# EasyEDA schematic easy-eda-project.json
TITLE: Lukso Tag - Build Up #2 Hackathon; REV: 3.0; Date: 2023-11-15; Sheet: 1/1; Drawn By: Tuszy; Company: Tuszy
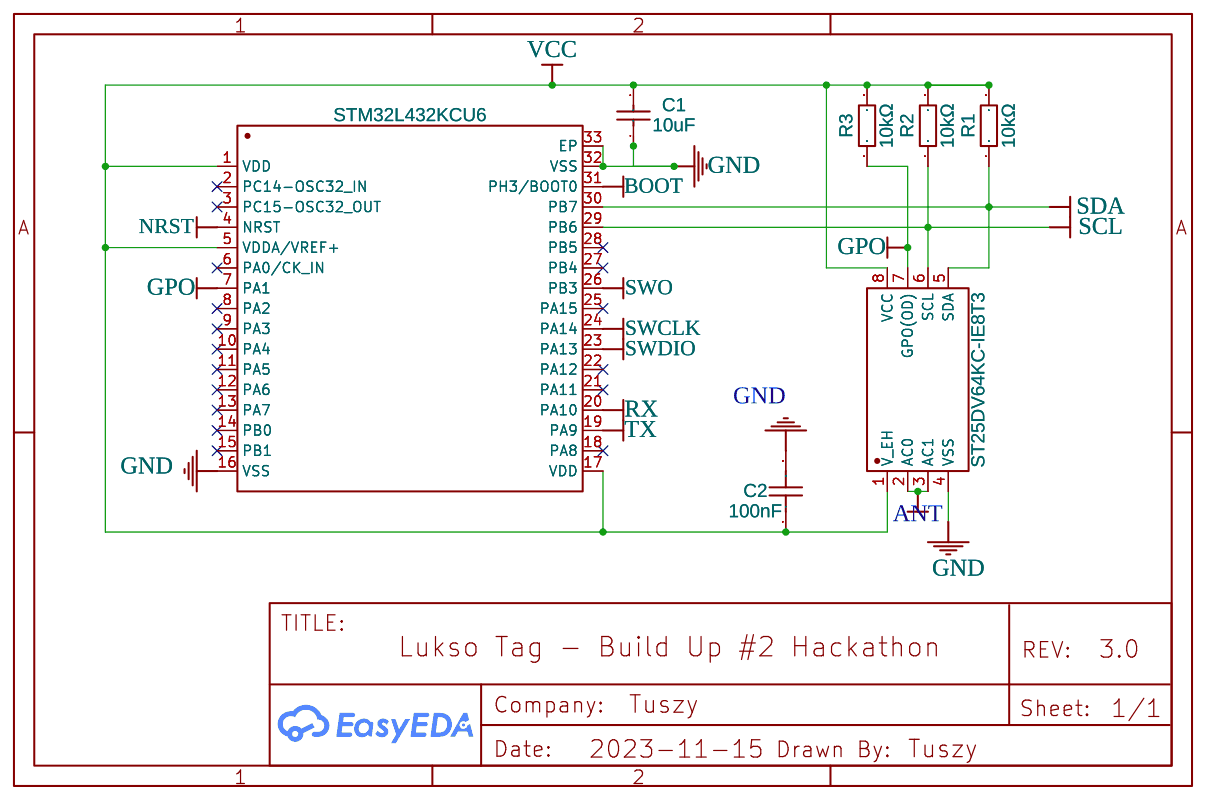
[diagram p0: schematic sheet]

## Parts
C1  10uF  [C0402]
C2  100nF  [C0402]
R1  10kΩ  [R0402]
R2  10kΩ  [R0402]
R3  10kΩ  [R0402]
U1  STM32L432KCU6  [UFQFPN-32_L5.0-W5.0-P0.50-TL-EP3.5]
U3  ST25DV64KC-IE8T3  [TSSOP-8_L4.4-W3.0-P0.65-LS6.4-BL]

## Library data of the parts
C1 = CL05A106MQ5NUNC: Supplier: LCSC; Manufacturer: SAMSUNG(三星); Supplier Part: C15525; JLCPCB Part Class: Basic Part; link: https://lcsc.com/eda_search?q=C15525&%26type=1&ref=editor
C2 = CC0402JRX7R7BB104: Contributor: LCSC; Supplier: LCSC; Supplier Part: C541464; Manufacturer: YAGEO(国巨); JLCPCB Part Class: Extended Part; link: https://lcsc.com/eda_search?q=C541464&%26type=1&ref=editor
R1-R3 = 0402WGF1002TCE: Supplier: LCSC; Manufacturer: UNI-ROYAL(厚声); Supplier Part: C25744; JLCPCB Part Class: Basic Part; link: https://lcsc.com/eda_search?q=C25744&%26type=1&ref=editor
U1 = STM32L432KCU6: Contributor: LCSC; Supplier: LCSC; Supplier Part: C1337280; Manufacturer: ST(意法半导体); JLCPCB Part Class: Extended Part; link: https://lcsc.com/eda_search?q=C1337280&%26type=1&ref=editor
U3 = ST25DV64KC-IE8T3: Contributor: lcsc; Supplier: LCSC; Supplier Part: C3304589; Manufacturer: ST(意法半导体); link: https://lcsc.com/eda_search?q=C3304589&%26type=1&ref=editor

## Nets
GND: C1.1 C2.2 U1.16(VSS) U1.32(VSS) U1.33(EP) U3.4(VSS)
VCC: C1.2 C2.1 R1.2 R2.2 R3.2 U1.1(VDD) U1.5(VDDA/VREF+) U1.17(VDD) U3.1(V_EH) U3.8(VCC)
ANT: U3.2(AC0) U3.3(AC1)
BOOT: U1.31(PH3/BOOT0)
GPO: R3.1 U1.7(PA1) U3.7(GPO(OD))
NRST: U1.4(NRST)
RX: U1.20(PA10)
SCL: R2.1 U1.29(PB6) U3.6(SCL)
SDA: R1.1 U1.30(PB7) U3.5(SDA)
SWCLK: U1.24(PA14)
SWDIO: U1.23(PA13)
SWO: U1.26(PB3)
TX: U1.19(PA9)

Not connected (* = marked no-connect by the designer): U1 2(PC14-OSC32_IN)* 3(PC15-OSC32_OUT)* 6(PA0/CK_IN)* 8(PA2)* 9(PA3)* 10(PA4)* 11(PA5)* 12(PA6)* 13(PA7)* 14(PB0)* 15(PB1)* 18(PA8)* 21(PA11)* 22(PA12)* 25(PA15)* 27(PB4)* 28(PB5)*
